# Altium project ATT-Open.PrjPcb
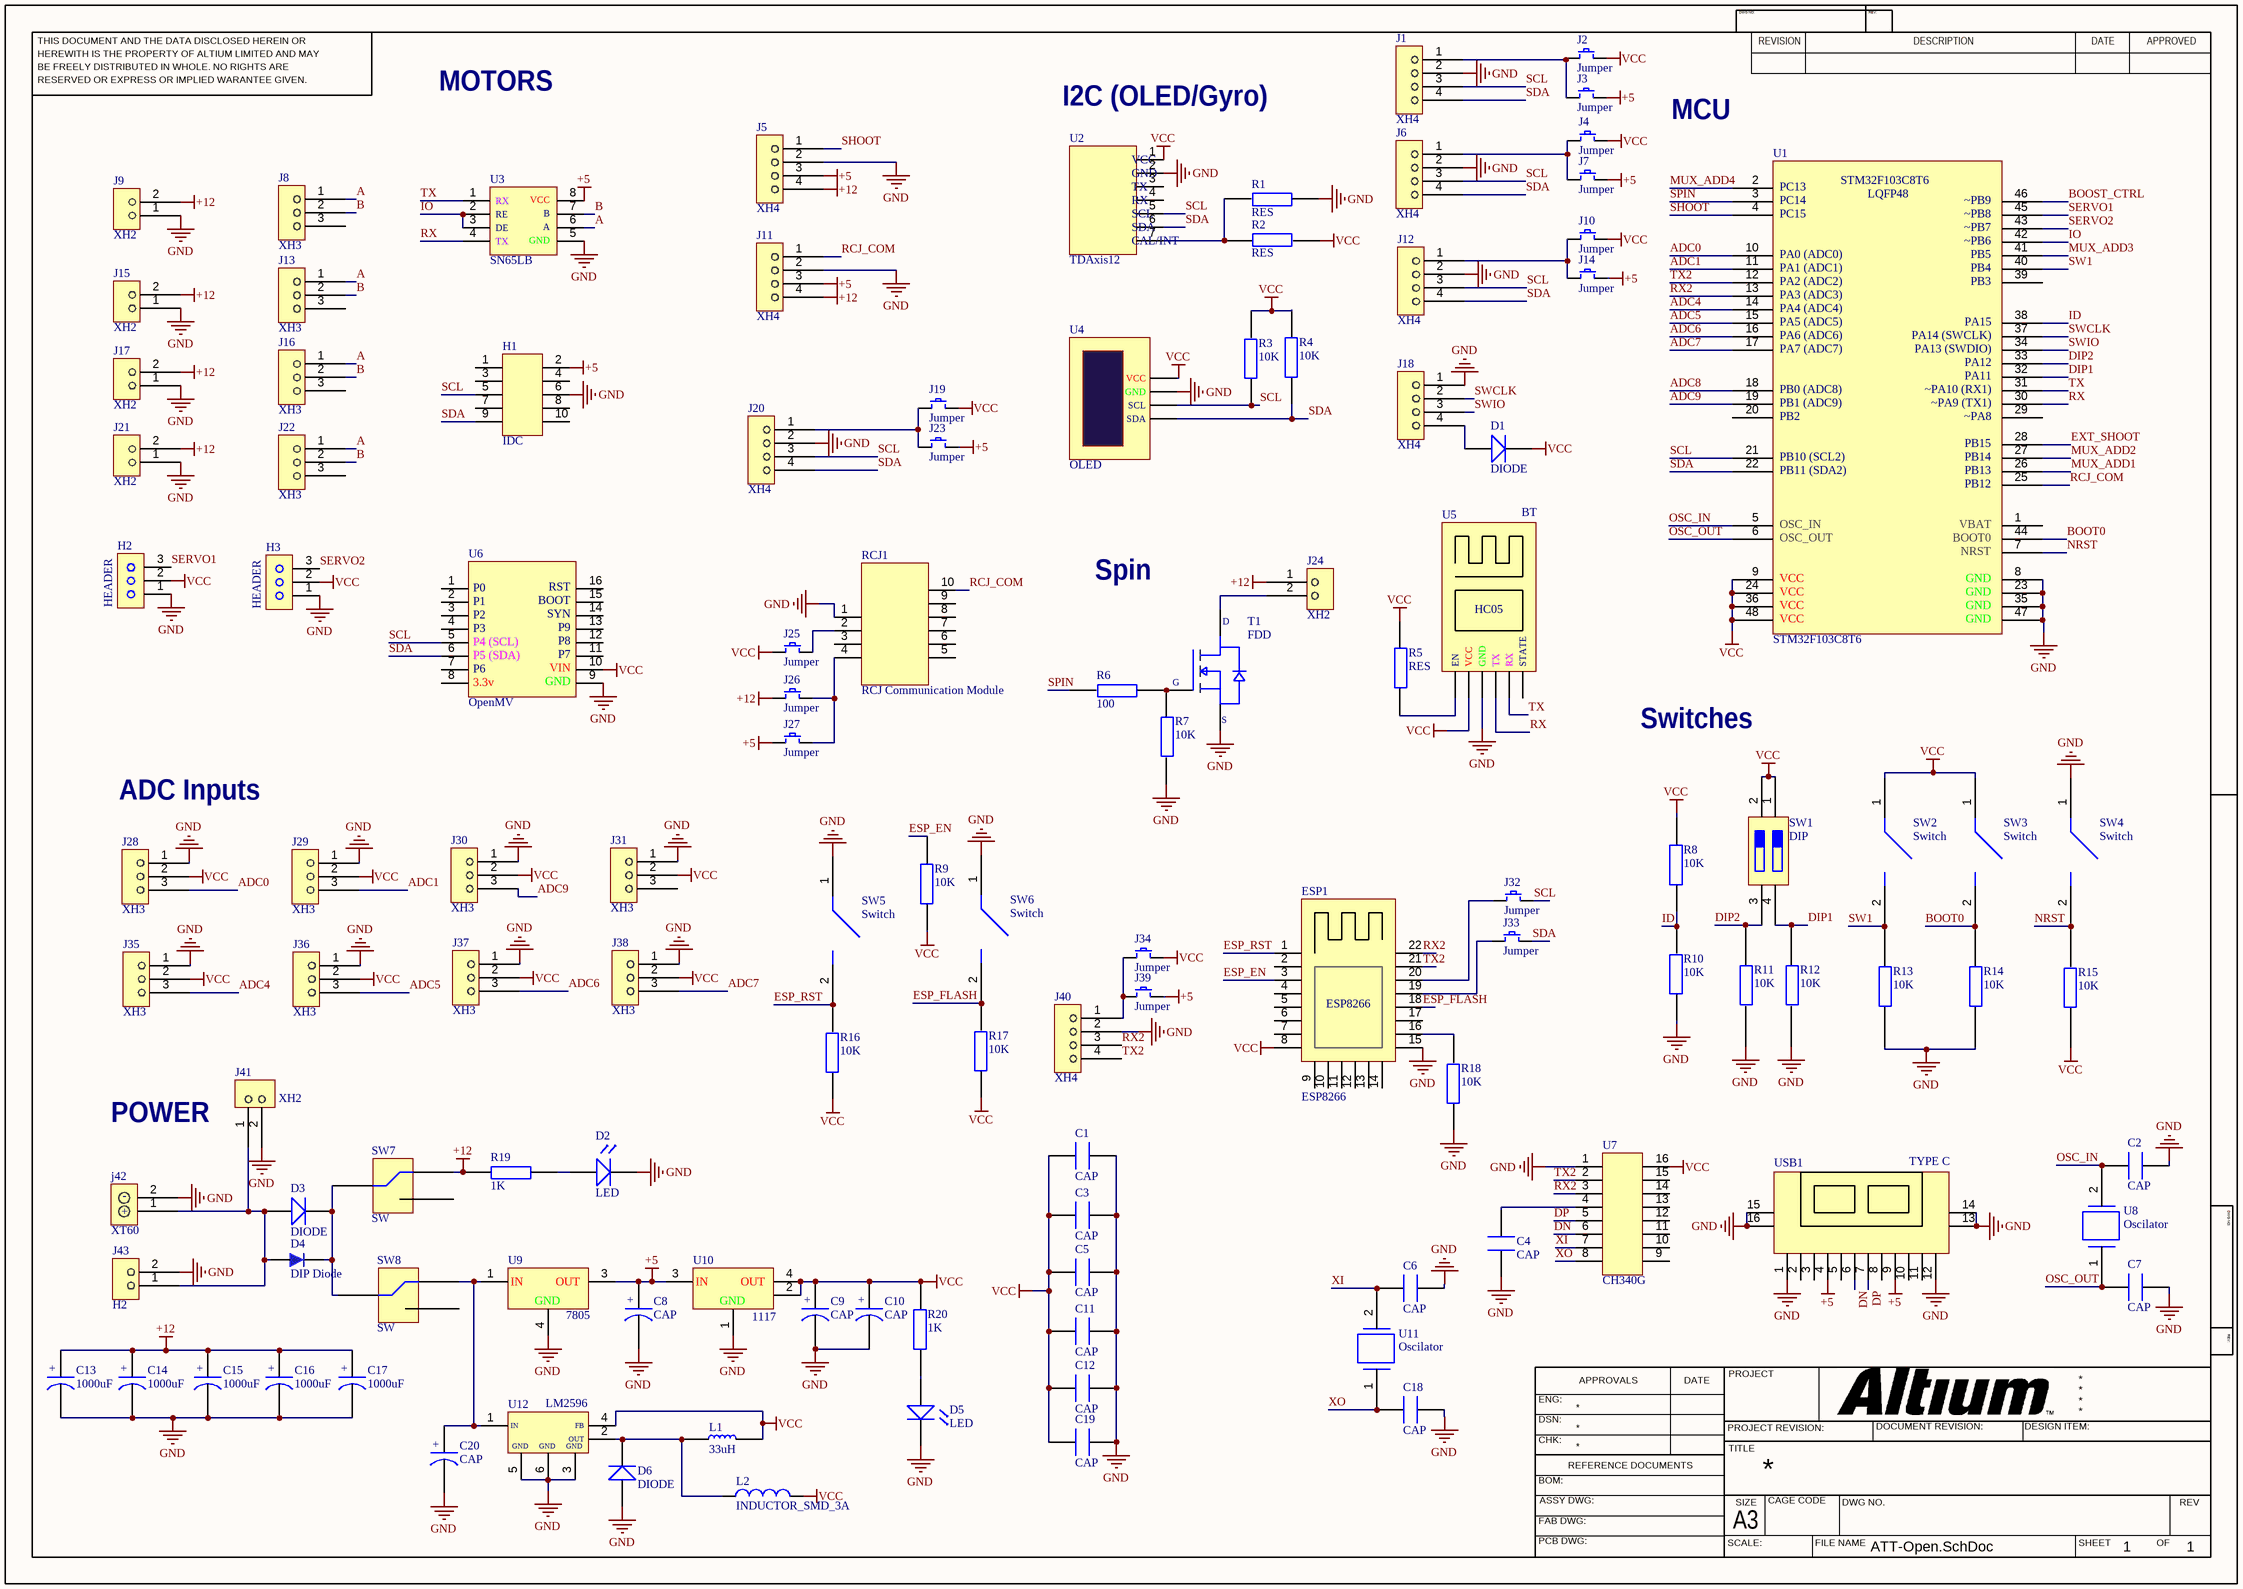
[diagram p0: ATT-Open.SchDoc]
1 sheet, 118 parts. Net scope: global (net labels, ports and power ports of the same name join across sheets).
Board file: ATT-Open.PcbDoc

## Sheet ATT-Open.SchDoc
size 420 x 297 mm; SheetNumber: 1; SheetTotal: 1

### Parts
C1  CAP  [CAP1206]
C2  CAP  [CAP1206]
C3  CAP  [CAP1206]
C4  CAP  [CAP1206]
C5  CAP  [CAP1206]
C6  CAP  [CAP1206]
C7  CAP  [CAP1206]
C8  CAP  [CAP SMD 100uF 16V]
C9  CAP  [CAP SMD 100uF 16V]
C10  CAP  [CAP SMD 100uF 16V]
C11  CAP  [CAP1206]
C12  CAP  [CAP1206]
C13  1000uF  [CAP 5x10x13 black]
C14  1000uF  [CAP 5x10x13 black]
C15  1000uF  [CAP 5x10x13 black]
C16  1000uF  [CAP 5x10x13 black]
C17  1000uF  [CAP 5x10x13 black]
C18  CAP  [CAP1206]
C19  CAP  [CAP1206]
C20  CAP  [CAP SMD 100uF 16V]
D1  DIODE  [Diode]
D2  LED  [LED GREEN 1206]
D3  DIODE  [Diode]
D4  DIP Diode  [Diode 1n4007]
D5  LED  [LED GREEN 1206]
D6  DIODE  [Diode]
ESP1  ESP8266  [ESP8266]
H1  IDC  [IDC 5x2]
H2  HEADER  [header 3 pin]
H3  HEADER  [header 3 pin]
J1  XH4  [XH 4PIN]
J2  Jumper  [Jumper]
J3  Jumper  [Jumper]
J4  Jumper  [Jumper]
J5  XH4  [XH 4PIN]
J6  XH4  [XH 4PIN]
J7  Jumper  [Jumper]
J8  XH3  [XH 3PIN]
J9  XH2  [XH 2pin]
J10  Jumper  [Jumper]
J11  XH4  [XH 4PIN]
J12  XH4  [XH 4PIN]
J13  XH3  [XH 3PIN]
J14  Jumper  [Jumper]
J15  XH2  [XH 2pin]
J16  XH3  [XH 3PIN]
J17  XH2  [XH 2pin]
J18  XH4  [XH 4PIN]
J19  Jumper  [Jumper]
J20  XH4  [XH 4PIN]
J21  XH2  [XH 2pin]
J22  XH3  [XH 3PIN]
J23  Jumper  [Jumper]
J24  XH2  [XH 2pin]
J25  Jumper  [Jumper]
J26  Jumper  [Jumper]
J27  Jumper  [Jumper]
J28  XH3  [XH 3PIN]
J29  XH3  [XH 3PIN]
J30  XH3  [XH 3PIN]
J31  XH3  [XH 3PIN]
J32  Jumper  [Jumper]
J33  Jumper  [Jumper]
J34  Jumper  [Jumper]
J35  XH3  [XH 3PIN]
J36  XH3  [XH 3PIN]
J37  XH3  [XH 3PIN]
J38  XH3  [XH 3PIN]
J39  Jumper  [Jumper]
J40  XH4  [XH 4PIN]
J41  XH2  [XH 2pin]
j42  XT60  [XT60]
J43  H2  [H2 MOLEX]
L1  33uH  [Inductor 1206]
L2  INDUCTOR_SMD_3A  [INDUCTOR_SMD_3A]
R1  RES  [RES1206]
R2  RES  [RES1206]
R3  10K  [RES1206]
R4  10K  [RES1206]
R5  RES  [RES1206]
R6  100  [RES1206]
R7  10K  [RES1206]
R8  10K  [RES1206]
R9  10K  [RES1206]
R10  10K  [RES1206]
R11  10K  [RES1206]
R12  10K  [RES1206]
R13  10K  [RES1206]
R14  10K  [RES1206]
R15  10K  [RES1206]
R16  10K  [RES1206]
R17  10K  [RES1206]
R18  10K  [RES1206]
R19  1K  [RES1206]
R20  1K  [RES1206]
RCJ1  RCJ Communication Module  [RCJ Communication Module]
SW1  DIP  [DIP Switch 2]
SW2  Switch  [pushbutton]
SW3  Switch  [pushbutton]
SW4  Switch  [pushbutton]
SW5  Switch  [pushbutton]
SW6  Switch  [pushbutton]
SW7  SW  [SPDT Switch]
SW8  SW  [SPDT Switch]
T1  FDD  [FDD6690A]
U1  STM32F103C8T6  [STM32F103C8T6]
U2  TDAxis12  [TDAxis12]
U3  SN65LB  [SN65LB]
U4  OLED  [OLED SH1106]
U5  BT  [HC05]
U6  OpenMV  [OpenMV]
U7  CH340G  [CH340G]
U8  Oscilator  [Crystal Oscilator]
U9  7805  [7805 (SOT-252)]
U10  1117  [AMS1117]
U11  Oscilator  [Crystal Oscilator]
U12  LM2596  [LM2596]
USB1  TYPE C  [USB Type C 12pin]

### Nets
+5: C8.2 H1.2 J3.2 J5.3 J7.2 J11.3 J14.2 J23.2 J27.1 J39.2 U3.8 U9.3 U10.3 USB1.4 USB1.9
+12: C13.2 C14.2 C15.2 C16.2 C17.2 J5.4 J9.2 J11.4 J15.2 J17.2 J21.2 J24.1 J26.1 R19.2 SW7.1
GND: C1.1 C2.2 C3.1 C4.1 C5.1 C6.2 C7.2 C8.1 C9.1 C10.1 C11.1 C12.1 C13.1 C14.1 C15.1 C16.1 C17.1 C18.2 C19.1 C20.1 D2.2 D5.2 D6.1 ESP1.15 H1.6 H2.1 H3.1 J1.2 J5.2 J6.2 J9.1 J11.2 J12.2 J15.1 J17.1 J18.1 J20.2 J21.1 J28.1 J29.1 J30.1 J31.1 J35.1 J36.1 J37.1 J38.1 J40.2 J41.2 j42.2 J43.2 R1.1 R7.2 R10.1 R11.2 R12.2 R13.2 R14.2 R18.1 RCJ1.1 SW4.1 SW5.1 SW6.1 T1.3 U1.8 U1.23 U1.35 U1.47 U2.2 U3.5 U4.2 U5.3 U6.9 U7.1 U9.4 U10.1 U12.3 U12.5 U12.6 USB1.1 USB1.12 USB1.13 USB1.14 USB1.15 USB1.16
VCC: C1.2 C3.2 C5.2 C9.2 C10.2 C11.2 C12.2 C19.2 D1.2 ESP1.8 H2.2 H3.2 J2.2 J4.2 J10.2 J19.2 J25.1 J28.2 J29.2 J30.2 J31.2 J34.2 J35.2 J36.2 J37.2 J38.2 L1.2 L2.2 R2.2 R3.2 R4.2 R5.1 R8.2 R9.1 R15.1 R16.1 R17.1 R20.2 SW1.1 SW1.2 SW2.1 SW3.1 U1.9 U1.24 U1.36 U1.48 U2.1 U4.1 U5.2 U6.10 U7.16 U10.2 U10.4 U12.4
A: J8.1 J13.1 J16.1 J22.1 U3.6
ADC0: J28.3 U1.10
ADC1: J29.3 U1.11
ADC4: J35.3 U1.14
ADC5: J36.3 U1.15
ADC6: J37.3 U1.16
ADC7: J38.3 U1.17
ADC8: U1.18
ADC9: J30.3 U1.19
B: J8.2 J13.2 J16.2 J22.2 U3.7
BOOST_CTRL: U1.46
BOOT0: R14.1 SW3.2 U1.44
DIP1: R12.1 SW1.4 U1.32
DIP2: R11.1 SW1.3 U1.33
DN: U7.6 USB1.6
DP: U7.5 USB1.7
ESP_EN: ESP1.3 R9.2
ESP_FLASH: ESP1.18 R17.2 SW6.2
ESP_RST: ESP1.1 R16.2 SW5.2
EXT_SHOOT: U1.28
ID: R8.1 R10.2 U1.38
IO: U1.42 U3.2 U3.3
MUX_ADD1: U1.26
MUX_ADD2: U1.27
MUX_ADD3: U1.41
MUX_ADD4: U1.2
NRST: R15.2 SW4.2 U1.7
OSC_IN: C2.1 U1.5 U8.2
OSC_OUT: C7.1 U1.6 U8.1
RCJ_COM: J11.1 RCJ1.10 U1.25
RX: U1.30 U3.4 U5.4
RX2: ESP1.22 J40.3 U1.13 U7.3
SCL: H1.5 J1.3 J6.3 J12.3 J20.3 J32.2 R3.1 U1.21 U2.5 U4.3 U6.5
SDA: H1.9 J1.4 J6.4 J12.4 J20.4 J33.2 R4.1 U1.22 U2.6 U4.4 U6.6
SERVO1: H2.3 U1.45
SERVO2: H3.3 U1.43
SHOOT: J5.1 U1.4
SPIN: R6.2 U1.3
SW1: R13.1 SW2.2 U1.40
SWCLK: J18.2 U1.37
SWIO: J18.3 U1.34
TX: U1.31 U3.1 U5.5
TX2: ESP1.21 J40.4 U1.12 U7.2
XI: C6.1 U7.7 U11.2
XO: C18.1 U7.8 U11.1
NetC4_2: C4.2 U7.4
NetC20_2: C20.2 SW8.1 U9.1 U12.1
NetD1_1: D1.1 J18.4
NetD2_1: D2.1 R19.1
NetD3_1: D3.1 D4.1 J41.1 j42.1 J43.1
NetD3_2: D3.2 D4.2 SW7.2 SW8.2
NetD5_1: D5.1 R20.1
NetD6_2: D6.2 L1.1 L2.1 U12.2
NetESP1_16: ESP1.16 R18.2
NetESP1_19: ESP1.19 J33.1
NetESP1_20: ESP1.20 J32.1
NetJ1_1: J1.1 J2.1 J3.1
NetJ4_1: J4.1 J6.1 J7.1
NetJ10_1: J10.1 J12.1 J14.1
NetJ19_1: J19.1 J20.1 J23.1
NetJ24_2: J24.2 T1.4
NetJ25_2: J25.2 RCJ1.2
NetJ26_2: J26.2 J27.2 RCJ1.4
NetJ34_1: J34.1 J39.1 J40.1
NetR1_2: R1.2 R2.1 U2.7
NetR5_2: R5.2 U5.1
NetR6_1: R6.1 R7.1 T1.1

Not connected (* = marked no-connect by the designer): ESP1 2 4 5 6 7 9 10 11 12 13 14 17; H1 1 3 4 7 8 10; J8 3; J13 3; J16 3; J22 3; J31 3; RCJ1 3 5 6 7 8 9; SW7 3; SW8 3; U1 1 20 29 39; U2 3 4; U5 6; U6 1 2 3 4 7 8 11 12 13 14 15 16; U7 9 10 11 12 13 14 15; USB1 2 3 5 8 10 11

### Notes on the sheet
- MOTORS
- (near U2) I2C (OLED/Gyro)
- MCU
- Spin
- Switches
- ADC Inputs
- POWER
- THIS DOCUMENT AND THE DATA DISCLOSED HEREIN OR
- HEREWITH IS THE PROPERTY OF ALTIUM LIMITED AND MAY
- DWG NO:
- REVISION
- REV:
- DESCRIPTION
- DATE
- APPROVED
- BE FREELY DISTRIBUTED IN WHOLE. NO RIGHTS ARE
- RESERVED OR EXPRESS OR IMPLIED WARANTEE GIVEN.
- ENG:
- APPROVALS
- PROJECT
- DSN:
- CHK:
- REFERENCE DOCUMENTS
- PROJECT REVISION:
- TITLE
- DOCUMENT REVISION:
- DESIGN ITEM:
- BOM:
- FAB DWG:
- PCB DWG:
- ASSY DWG:
- SCALE:
- A3
- SIZE
- CAGE CODE
- FILE NAME
- DWG NO.
- SHEET
- OF
- REV
- (in symbol 7805 (SOT-252)) IN; OUT; GND
- (in symbol AMS1117) IN; OUT; GND
- (in symbol CAP Electrolit SMD) +
- (in symbol Cap Electrolyte) +
- (in symbol FDD6690A) D; G; S
- (in symbol HC05) EN; VCC; GND; TX; RX; STATE
- (in symbol IRF540S) D; G; S
- (in symbol LM2596) IN; FB; OUT; GND
- (in symbol OLED SH1106) VCC; GND; SCL; SDA
- (in symbol OpenMV) RST; P0; BOOT; P1; SYN; P2; P9; P3; P8; P4 (SCL); P7; P5 (SDA); VIN; P6; GND; 3.3v
- (in symbol SN65LB) RX; VCC; RE; B; DE; A; TX; GND
- (in symbol STM32F103C8T6) PC13; LQFP48; ~PB9; PC14; ~PB8; PC15; ~PB7; ~PB6; PB5; PA0 (ADC0); PB4; PA1 (ADC1); PB3; PA2 (ADC2); PA3 (ADC3); PA4 (ADC4); PA15; PA5 (ADC5); PA14 (SWCLK); PA6 (ADC6); PA13 (SWDIO); PA7 (ADC7); PA12; PA11; ~PA10 (RX1); PB0 (ADC8); ~PA9 (TX1); PB1 (ADC9); ~PA8; PB2; PB15; PB14; PB10 (SCL2); PB13; PB11 (SDA2); PB12; VBAT; OSC_IN; BOOT0; OSC_OUT; NRST; GND; VCC
- (in symbol TDAxis12) VCC; GND; TX; RX; SCL; SDA; CAL/INT
- (in symbol XT60) -; +

### Library data of the parts
C1-C7 C11 C12 C18 C19 = CAP1206: Capacitor SMD 1206
C8-C10 C20 = CAP Electrolit SMD: Capacitor Electrolit SMD
C13-C17 = Cap Electrolyte: CAP DIP
D2 D5 = LED SMD 1206
D4 = Diode DIP Package: Published: 8-Jun-2000; LatestRevisionDate: 17-Jul-2002; LatestRevisionNote: Re-released for DXP Platform.; DatasheetVersion: 1997; Publisher: Altium Limited; PackageDescription: Diode, Axial; Body 3.8 x 1.9 mm (LxDia. max), Lead Dia. 0.53 mm (max); Code_JEDEC: DO-204-AH; ComponentLink1Description: Manufacturer Link; ComponentLink1URL: http://www.fairchildsemi.com/; ComponentLink2Description: Datasheet; ComponentLink2URL: http://www.fairchildsemi.com/ds/1N%2F1N4148.pdf
H1 = IDC BOX 5x2
H2 H3 = Header 3 pin
J1 J5 J6 J11 J12 J18 J20 J40 = XH 4PIN: XH Connector 4pins
J8 J13 J16 J22 J28-J31 J35-J38 = XH 3PIN: XH Connector 3pins
J9 J15 J17 J21 J24 J41 = XH 2PIN: XH Connector 2pins
j42 = XT60: XT60 Power Connector
J43 = H2 MOLEX: molex connector
L1 = Inductor 1206
R1-R20 = RES1206: RESISTOR SMD
SW1 = DIP SW 2: DIP Switch 2 pin
SW2-SW6 = pushbutton: Switch SMD Tact
SW7 SW8 = SPDT Switch: SPDT Power Switch
T1 = FDD6690A: FDD6690A MOSFET N-Chanel
U1 = STM32F103C8T6: STM32F103C8T6 / LQFP48
U2 = TDAxis12: Gyroscpoe Sensor
U3 = SN65LB: BL DC MOTOR DRIVER
U4 = OLED SH1106: OLED SH1106 1.3inch
U5 = HC05: Bluetooth HC05 Module
U6 = OpenMV: OpenMV Camera H7 R2
U8 U11 = Crystal: Crystal Oscilator 8MHz
U9 = 7805 (SOT-252): 5v Regulator
U10 = AMS1117: 3.3v Regulator
U12 = LM2596: 3.3v Regulator (Switching)
USB1 = USB Type C 12pin